# Altium schematic sheet Filter.SchDoc
size A; DocumentNumber: 2; SheetNumber: 2; SheetTotal: 3; PageSetup: Record=PageOptions|CenterHorizontal=True|CenterVertical=True|PrintScale=0.47|XCorrection=1.00|YCorrection=1.00|PrintKind=1|BorderSize=5000000|LeftOffset=0|BottomOffset=0|Orientation=2|PaperLength=1000|PaperWidth=1000|Scale=100|PaperSource=15|PrintQuality=1200|MediaType=1|DitherType=10|PaperKind=Letter|PrintScaleMode=1
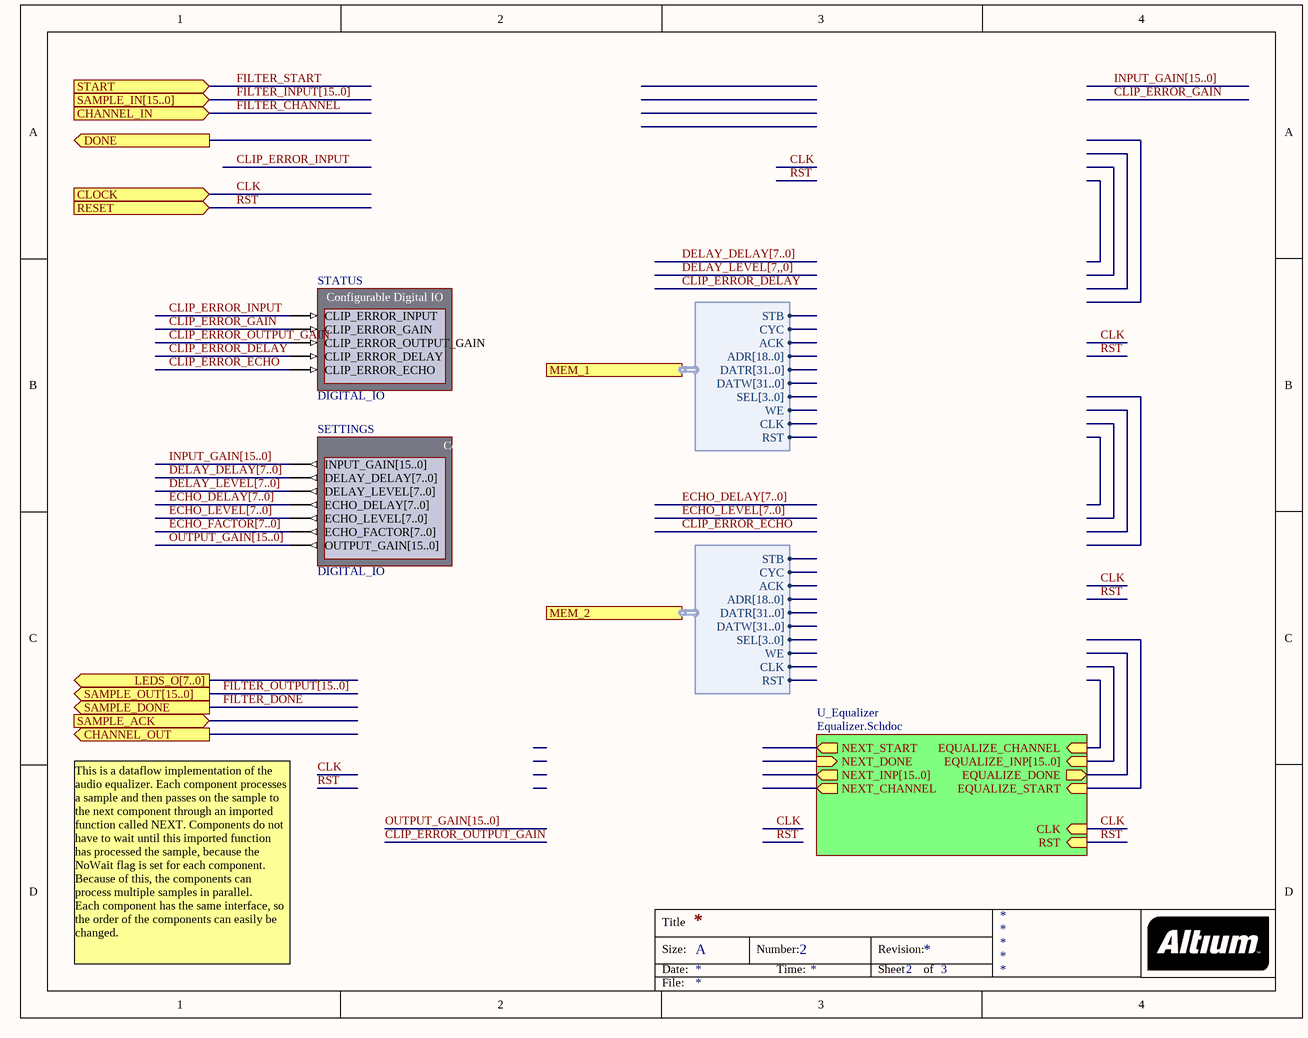
[diagram p0: Filter.SchDoc]

## Parts
SETTINGS  DIGITAL_IO
STATUS  DIGITAL_IO

## Sub-sheets
U_Equalizer = Equalizer.Schdoc: EQUALIZE_START (in), EQUALIZE_DONE (out), EQUALIZE_CHANNEL (in), EQUALIZE_INP[15..0] (in), CLK (in), RST (in), NEXT_INP[15..0] (out), NEXT_CHANNEL (out), NEXT_DONE (in), NEXT_START (out)

## Ports
CHANNEL_IN (in), CHANNEL_OUT (out), CLOCK (in), DONE (out), LEDS_O[7..0] (out), MEM_1 (harness WB_19_32_8), MEM_2 (harness WB_19_32_8), RESET (in), SAMPLE_ACK (in), SAMPLE_DONE (out), SAMPLE_IN[15..0] (in), SAMPLE_OUT[15..0] (out), START (in)

## Harnesses
WB_19_32_8: STB, CYC, ACK, ADR[18..0], DATR[31..0], DATW[31..0], SEL[3..0], WE, CLK, RST

## Nets
CLIP_ERROR_DELAY: STATUS.CLIP_ERROR_DELAY
CLIP_ERROR_ECHO: STATUS.CLIP_ERROR_ECHO
CLIP_ERROR_GAIN: STATUS.CLIP_ERROR_GAIN
CLIP_ERROR_INPUT: STATUS.CLIP_ERROR_INPUT
CLIP_ERROR_OUTPUT_GAIN: STATUS.CLIP_ERROR_OUTPUT_GAIN
CLK: port CLOCK, sheet U_Equalizer/CLK
DELAY_DELAY[7..0]: SETTINGS.DELAY_DELAY[7..0]
DELAY_LEVEL[7..0]: SETTINGS.DELAY_LEVEL[7..0]
ECHO_DELAY[7..0]: SETTINGS.ECHO_DELAY[7..0]
ECHO_FACTOR[7..0]: SETTINGS.ECHO_FACTOR[7..0]
ECHO_LEVEL[7..0]: SETTINGS.ECHO_LEVEL[7..0]
FILTER_CHANNEL: port CHANNEL_IN
FILTER_DONE: port SAMPLE_DONE
FILTER_START: port START
INPUT_GAIN[15..0]: SETTINGS.INPUT_GAIN[15..0]
OUTPUT_GAIN[15..0]: SETTINGS.OUTPUT_GAIN[15..0]
RST: port RESET, sheet U_Equalizer/RST

## Buses and harness runs
bus DELAY_DELAY[7..0]
bus DELAY_LEVEL[7,,0]
bus DELAY_LEVEL[7..0]
bus ECHO_DELAY[7..0]
bus ECHO_FACTOR[7..0]
bus ECHO_LEVEL[7..0]
bus FILTER_INPUT[15..0] = port SAMPLE_IN[15..0]
bus FILTER_OUTPUT[15..0] = port SAMPLE_OUT[15..0]
bus INPUT_GAIN[15..0]
bus OUTPUT_GAIN[15..0]

## Notes on the sheet
- This is a dataflow implementation of the audio equalizer. Each component processes a sample and then passes on the sample to the next component through an imported function called NEXT. Components do not have to wait until this imported function has processed the sample, because the NoWait flag is set for each component. Because of this, the components can process multiple samples in parallel.
  Each component has the same interface, so the order of the components can easily be changed.
- Title
- Size:
- Date:
- A
- Number:
- Time:
- Revision:
- Sheet
- of
- File:

## Library data of the parts
SETTINGS = DIGITAL_IO: Configurable Digital IO; NEXUS_CORE: Instrument; NEXUS_JTAG_DEVICE: True; NEXUS_JTAG_ORDER: 0; ConfigurationParameters: {}Version[2,0]{}StorageType[3]{}InterfaceType[Parallel]{}SchCompWidth[100]{}NoInputs[ ]{}Output0Name[INPUT_GAIN{1}15..0{2}]{}Output0Width[16]{}Output0InitValue[4096]{}Output0Kind[Numeric]{}Output0NumRadix[Binary]{}Output1Name[DELAY_DELAY{1}7..0{2}]{}Output1Width[8]{}Output1InitValue[0]{}Output1Kind[Numeric]{}Output1NumRadix[Binary]{}Output2Name[DELAY_LEVEL{1}7..0{2}]{}Output2Width[8]{}Output2InitValue[0]{}Output2Kind[Numeric]{}Output2NumRadix[Binary]{}Output3Name[ECHO_DELAY{1}7..0{2}]{}Output3Width[8]{}Output3InitValue[0]{}Output3Kind[Numeric]{}Output3NumRadix[Binary]{}Output4Name[ECHO_LEVEL{1}7..0{2}]{}Output4Width[8]{}Output4InitValue[0]{}Output4Kind[Numeric]{}Output4NumRadix[Binary]{}Output5Name[ECHO_FACTOR{1}7..0{2}]{}Output5Width[8]{}Output5InitValue[0]{}Output5Kind[Numeric]{}Output5NumRadix[Binary]{}Output6Name[OUTPUT_GAIN{1}15..0{2}]{}Output6Width[16]{}Output6InitValue[4096]{}Output6Kind[Numeric]{}Output6NumRadix[Binary]{}Designator[SETTINGS]{}InternalID[2]{}; ConfiguratorName: DIGITAL_IO; ComponentLink1Description: Core &Resource Usage; ComponentLink1URL: CR0134 FPGA Instrument Resource Usage.pdf; Core Revision: 1.00.00; HelpURL: CR0179 DIGITAL_IO Configurable Digital IO Module.pdf; LastRevisionNo: 1.00.00; Published: 28-Jun-2007; Publisher: Altium Limited; UseInDSF: True
STATUS = DIGITAL_IO: Configurable Digital IO; NEXUS_CORE: Instrument; NEXUS_JTAG_DEVICE: True; NEXUS_JTAG_ORDER: 0; ConfigurationParameters: {}Version[2,0]{}StorageType[3]{}InterfaceType[Parallel]{}SchCompWidth[100]{}Input0Name[CLIP_ERROR_INPUT]{}Input0Width[1]{}Input0InitValue[0]{}Input0Kind[LEDs]{}Input0LEDStyle[Red]{}Input1Name[CLIP_ERROR_GAIN]{}Input1Width[1]{}Input1InitValue[0]{}Input1Kind[LEDs]{}Input1LEDStyle[Red]{}Input2Name[CLIP_ERROR_OUTPUT_GAIN]{}Input2Width[1]{}Input2InitValue[0]{}Input2Kind[LEDs]{}Input2LEDStyle[Red]{}Input3Name[CLIP_ERROR_DELAY]{}Input3Width[1]{}Input3InitValue[0]{}Input3Kind[LEDs]{}Input3LEDStyle[Red]{}Input4Name[CLIP_ERROR_ECHO]{}Input4Width[1]{}Input4InitValue[0]{}Input4Kind[LEDs]{}Input4LEDStyle[Red]{}NoOutputs[ ]{}Designator[STATUS]{}InternalID[3]{}; ConfiguratorName: DIGITAL_IO; ComponentLink1Description: Core &Resource Usage; ComponentLink1URL: CR0134 FPGA Instrument Resource Usage.pdf; Core Revision: 1.00.00; HelpURL: CR0179 DIGITAL_IO Configurable Digital IO Module.pdf; LastRevisionNo: 1.00.00; Published: 28-Jun-2007; Publisher: Altium Limited; UseInDSF: True